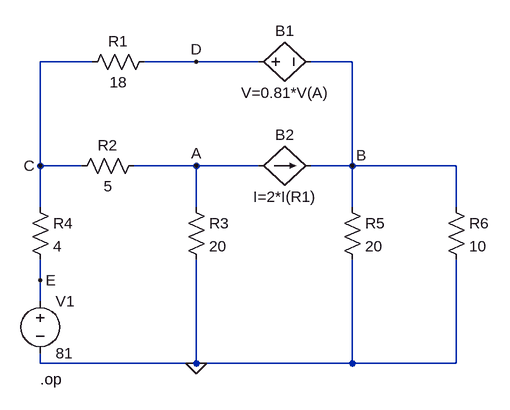
[diagram p0: schematic ckt1.asc]
ckt1.asc, the LTspice schematic file:
Version 4
SHEET 1 880 680
WIRE 96 48 16 48
WIRE 256 48 176 48
WIRE 352 48 256 48
WIRE 496 48 432 48
WIRE 16 208 16 48
WIRE 80 208 16 208
WIRE 256 208 160 208
WIRE 352 208 256 208
WIRE 496 208 496 48
WIRE 496 208 432 208
WIRE 656 208 496 208
WIRE 16 272 16 208
WIRE 256 272 256 208
WIRE 496 272 496 208
WIRE 656 272 656 208
WIRE 16 384 16 352
WIRE 16 416 16 384
WIRE 16 512 16 496
WIRE 256 512 256 352
WIRE 256 512 16 512
WIRE 496 512 496 352
WIRE 496 512 256 512
WIRE 656 512 656 352
WIRE 656 512 496 512
FLAG 256 512 0
FLAG 256 208 A
FLAG 496 208 B
FLAG 16 208 C
FLAG 256 48 D
FLAG 16 384 E
SYMBOL bv 336 48 R270
WINDOW 0 32 56 VTop 2
WINDOW 3 -32 56 VBottom 2
SYMATTR InstName B1
SYMATTR Value V=0.81*V(A)
SYMBOL res 240 256 R0
SYMATTR InstName R3
SYMATTR Value 20
SYMBOL res 0 256 R0
SYMATTR InstName R4
SYMATTR Value 4
SYMBOL voltage 16 400 R0
SYMATTR InstName V1
SYMATTR Value 81
SYMBOL res 480 256 R0
SYMATTR InstName R5
SYMATTR Value 20
SYMBOL bi 352 208 R270
WINDOW 0 32 40 VTop 2
WINDOW 3 -32 40 VBottom 2
SYMATTR InstName B2
SYMATTR Value I=2*I(R1)
SYMBOL res 640 256 R0
SYMATTR InstName R6
SYMATTR Value 10
SYMBOL res 80 64 R270
WINDOW 0 32 56 VTop 2
WINDOW 3 0 56 VBottom 2
SYMATTR InstName R1
SYMATTR Value 18
SYMBOL res 64 224 R270
WINDOW 0 32 56 VTop 2
WINDOW 3 0 56 VBottom 2
SYMATTR InstName R2
SYMATTR Value 5
TEXT 16 536 Left 2 !.op

The netlist it stands for:
* ckt1.asc
B1 D B V=0.81*V(A)
R3 A 0 20
R4 C E 4
V1 E 0 81
R5 B 0 20
B2 A B I=2*I(R1)
R6 B 0 10
R1 C D 18
R2 C A 5
.op
.backanno
.end

* Results of the author's LTspice run, read from the files saved beside the schematic
* Operating Point:
*   V(d) = 50.71 V
*   V(b) = 14.18 V
*   V(a) = 45.11 V
*   V(c) = 63.47 V
*   V(e) = 81 V
*   I(B1) = 708.9 mA
*   I(B2) = 1.418 A
*   I(R3) = 2.255 A
*   I(R4) = -4.382 A
*   I(R5) = 708.8 mA
*   I(R6) = 1.418 A
*   I(R1) = 708.9 mA
*   I(R2) = 3.673 A
*   I(V1) = -4.382 A